# Altium schematic sheet Final_LDO.SchDoc
size A; SheetNumber: 1; SheetTotal: 1
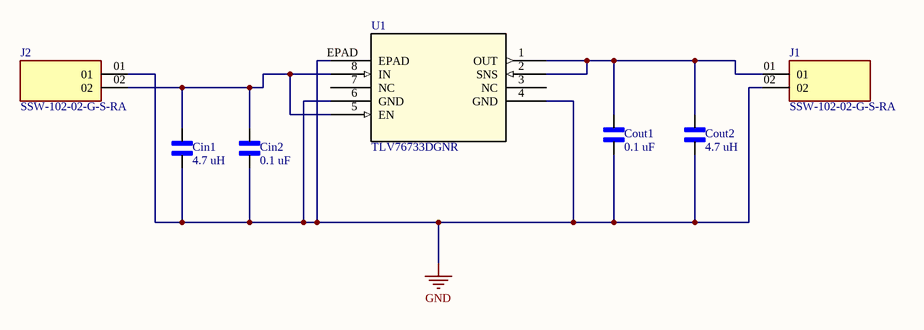
[diagram p0: Final_LDO.SchDoc]

## Parts
Cin1  value 4.7 uH  [CAPC2012X140N]  (hidden comment: GRM21BR71A106KA73L)
Cin2  value 0.1 uF  [CAPC1608X95]  (hidden comment: C1608X7R1C104KT)
Cout1  value 0.1 uF  [CAPC1608X95]  (hidden comment: C1608X7R1C104KT)
Cout2  value 4.7 uH  [CAPC2012X140N]  (hidden comment: GRM21BR71A106KA73L)
J1  SSW-102-02-G-S-RA  [SAMTEC_SSW-102-02-G-S-RA]
J2  SSW-102-02-G-S-RA  [SAMTEC_SSW-102-02-G-S-RA]
U1  TLV76733DGNR  [VSSOP8_DGN_TEX]

## Nets
GND: Cin1.1 Cin2.2 Cout1.2 Cout2.1 J1.02 J2.01 U1.4(GND) U1.6(GND) U1.EPAD
NetCin1_2: Cin1.2 Cin2.1 J2.02 U1.5(EN) U1.8(IN)
NetCout1_1: Cout1.1 Cout2.2 J1.01 U1.1(OUT) U1.2(SNS)

Not connected (* = marked no-connect by the designer): U1 3(NC) 7(NC)

## Library data of the parts
Cin1 Cout2 = CMP-025-000000-1: SMD capacitor X7R(EIA) with capacitance 10uF Tol.10%. Rated voltage 10Vdc 125C; MF: Murata Electronics; Package: 2012 Murata; Component Type: Standard; Check_prices: https://www.snapeda.com/parts/GRM21BR71A106KA73L/Murata+Electronics+North+America/view-part/?ref=eda; SnapEDA_Link: https://www.snapeda.com/parts/GRM21BR71A106KA73L/Murata+Electronics+North+America/view-part/?ref=snap; Design Item ID: GRM21BR71A106KA73L; MP: GRM21BR71A106KA73L; Source: GRM21BR71A106KA73L.SchLib; Pin Count: 2
Cin2 Cout1 = CMP-031-000000-1: 0.1 ÂµF Â±10% 16V Ceramic Capacitor X7R 0603 (1608 Metric); MF: TDK; Pin Count: 2; MP: C1608X7R1C104KT; Check_prices: https://www.snapeda.com/parts/C1608X7R1C104KT/TDK/view-part/?ref=eda; Component Type: Standard; Package: 0603 TDK; Source: C1608X7R1C104KT.SchLib; Design Item ID: C1608X7R1C104KT; SnapEDA_Link: https://www.snapeda.com/parts/C1608X7R1C104KT/TDK/view-part/?ref=snap
J1 J2 = SSW-102-02-G-S-RA: MF: Samtec; Package: None; Price: None; Availability: Unavailable; MP: SSW-102-02-G-S-RA; Value: *
U1 = TLV76733DGNR: Adjustable- and fixed-output, 1-A, 16-V, positive-voltage low-dropout (LDO) linear regulator 8-HVSSOP -40 to 125; Manufacturer_Name: Texas Instruments; Type: Power Management; Copyright: Copyright (C) 2025 Ultra Librarian. All rights reserved.; Manufacturer_Part_Number: TLV76733DGNR; RefDes: RefDes